# Altium schematic sheet 05_FEEDBACK_OUTPUTS.SchDoc
size A3
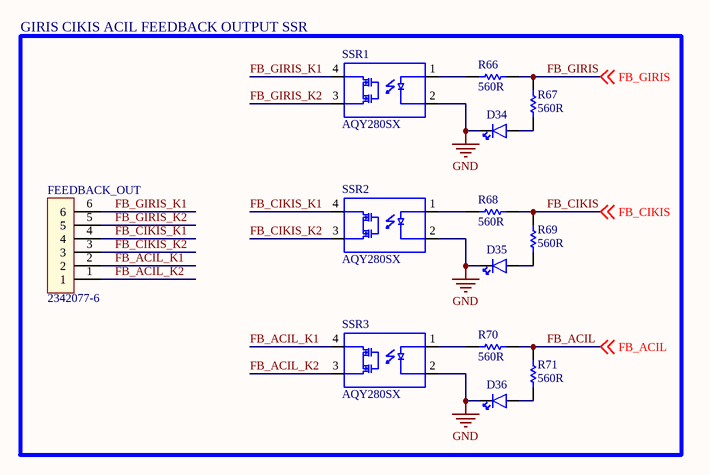
[diagram p0: 05_FEEDBACK_OUTPUTS.SchDoc]

## Parts
D34  led_green  [805LED]  (value not drawn)
D35  led_green  [805LED]  (value not drawn)
D36  led_green  [805LED]  (value not drawn)
FEEDBACK_OUT  2342077-6  [TERM BLOCK HDR 6POS 90DEG PITCH 3.81MM]
R66  560R  [603R]
R67  560R  [603R]
R68  560R  [603R]
R69  560R  [603R]
R70  560R  [603R]
R71  560R  [603R]
SSR1  AQY280SX  [SOP254P680X220-4N]
SSR2  AQY280SX  [SOP254P680X220-4N]
SSR3  AQY280SX  [SOP254P680X220-4N]

## Blocks framed on the sheet
GIRIS CIKIS ACIL FEEDBACK OUTPUT SSR: D34-D36 FEEDBACK_OUT R66-R71 SSR1-SSR3

## Nets
GND: D34.2(K) D35.2(K) D36.2(K) SSR1.2 SSR2.2 SSR3.2
FB_ACIL: R70.1 R71.2 ; off-sheet FB_ACIL
FB_ACIL_K1: FEEDBACK_OUT.2 SSR3.4
FB_ACIL_K2: FEEDBACK_OUT.1 SSR3.3
FB_CIKIS: R68.1 R69.2 ; off-sheet FB_CIKIS
FB_CIKIS_K1: FEEDBACK_OUT.4 SSR2.4
FB_CIKIS_K2: FEEDBACK_OUT.3 SSR2.3
FB_GIRIS: R66.1 R67.2 ; off-sheet FB_GIRIS
FB_GIRIS_K1: FEEDBACK_OUT.6 SSR1.4
FB_GIRIS_K2: FEEDBACK_OUT.5 SSR1.3
NetD34_1: D34.1(A) R67.1
NetD35_1: D35.1(A) R69.1
NetD36_1: D36.1(A) R71.1
NetR66_2: R66.2 SSR1.1
NetR68_2: R68.2 SSR2.1
NetR70_2: R70.2 SSR3.1

## Library data of the parts
D34-D36 = LED_GREEN_0805: LED 2X1.2MM 570NM GN WTR CLR SMD; Millicandela Rating: 50mcd; Voltage - Forward (Vf): 2.1V; value: led_green; Digi-Key Part Number: 754-1127-1-ND; Case: 0805; Viewing Angle: -
FEEDBACK_OUT = TERM BLOCK HDR 6POS 90DEG 3.81MM: 6 Position Terminal Block Header, Male Pins, Shrouded (4 Side) 0.150" (3.81mm) 90°, Right Angle - Through Hole; Manufacturer: TE Connectivity AMP Connectors; Contact Tail Length: 0.075" (1.90mm); Digi-Key Part Number: A145325-ND; Value: 2342077-6; Pitch: 0.150" (3.81mm); Header Orientation: 90°, Right Angle; Insulation Height: 0.285" (7.25mm)
R66-R71 = RES_560_OHM_%5_0.1W_0603: 560 Ohms ±5% 0.1W, 1/10W Chip Resistor 0603 (1608 Metric) Moisture Resistant Thick Film; Manufacturer: Yageo; Manufacturer Part Number: RC0603JR-07560RL; Temperature Coefficient: ±100ppm/°C; Value: 560R; Digi-Key Part Number: 311-560GRCT-ND; Tolerance: ±5%; Power (Watts): 0.1W, 1/10W; Composition: Thick Film; Operating Temperature: -55°C ~ 155°C; Package / Case: 0603 (1608 Metric); Size / Dimension: 0.063" L x 0.032" W (1.60mm x 0.80mm); Height - Seated (Max): 0.022" (0.55mm); Features: Moisture Resistant
SSR1-SSR3 = SSR RELAY SPST-NO 120MA 0-350V AQY280SX: Solid State SPST-NO (1 Form A) AC/DC 0-350V 150mA 4-SOP (0.173", 4.40mm); Manufacturer: Panasonic Electric Works; Output Type: AC, DC; Voltage - Input: 1.14VDC; Voltage - Load: 0 V ~ 350 V; Load Current: 120 mA; On-State Resistance (Max): 25 Ohms; Digi-Key Part Number: 255-3913-1-ND; Value: AQY280SX; Circuit: SPST-NO (1 Form A); Package / Case: 4-SOP (0.173", 4.40mm)